# EasyEDA Pro project ProPrj_stm32_SmartCar.epro

# Schematic Schematic1
Board Name: Board1; Create Date: 2025-04-12; Page Name: P1; Project Name: stm32_SmartCar; Schematic Name: Schematic1; Update Date: 2025-04-12; Company: 嘉立创EDA; Page Size: A4; Version: V1.0
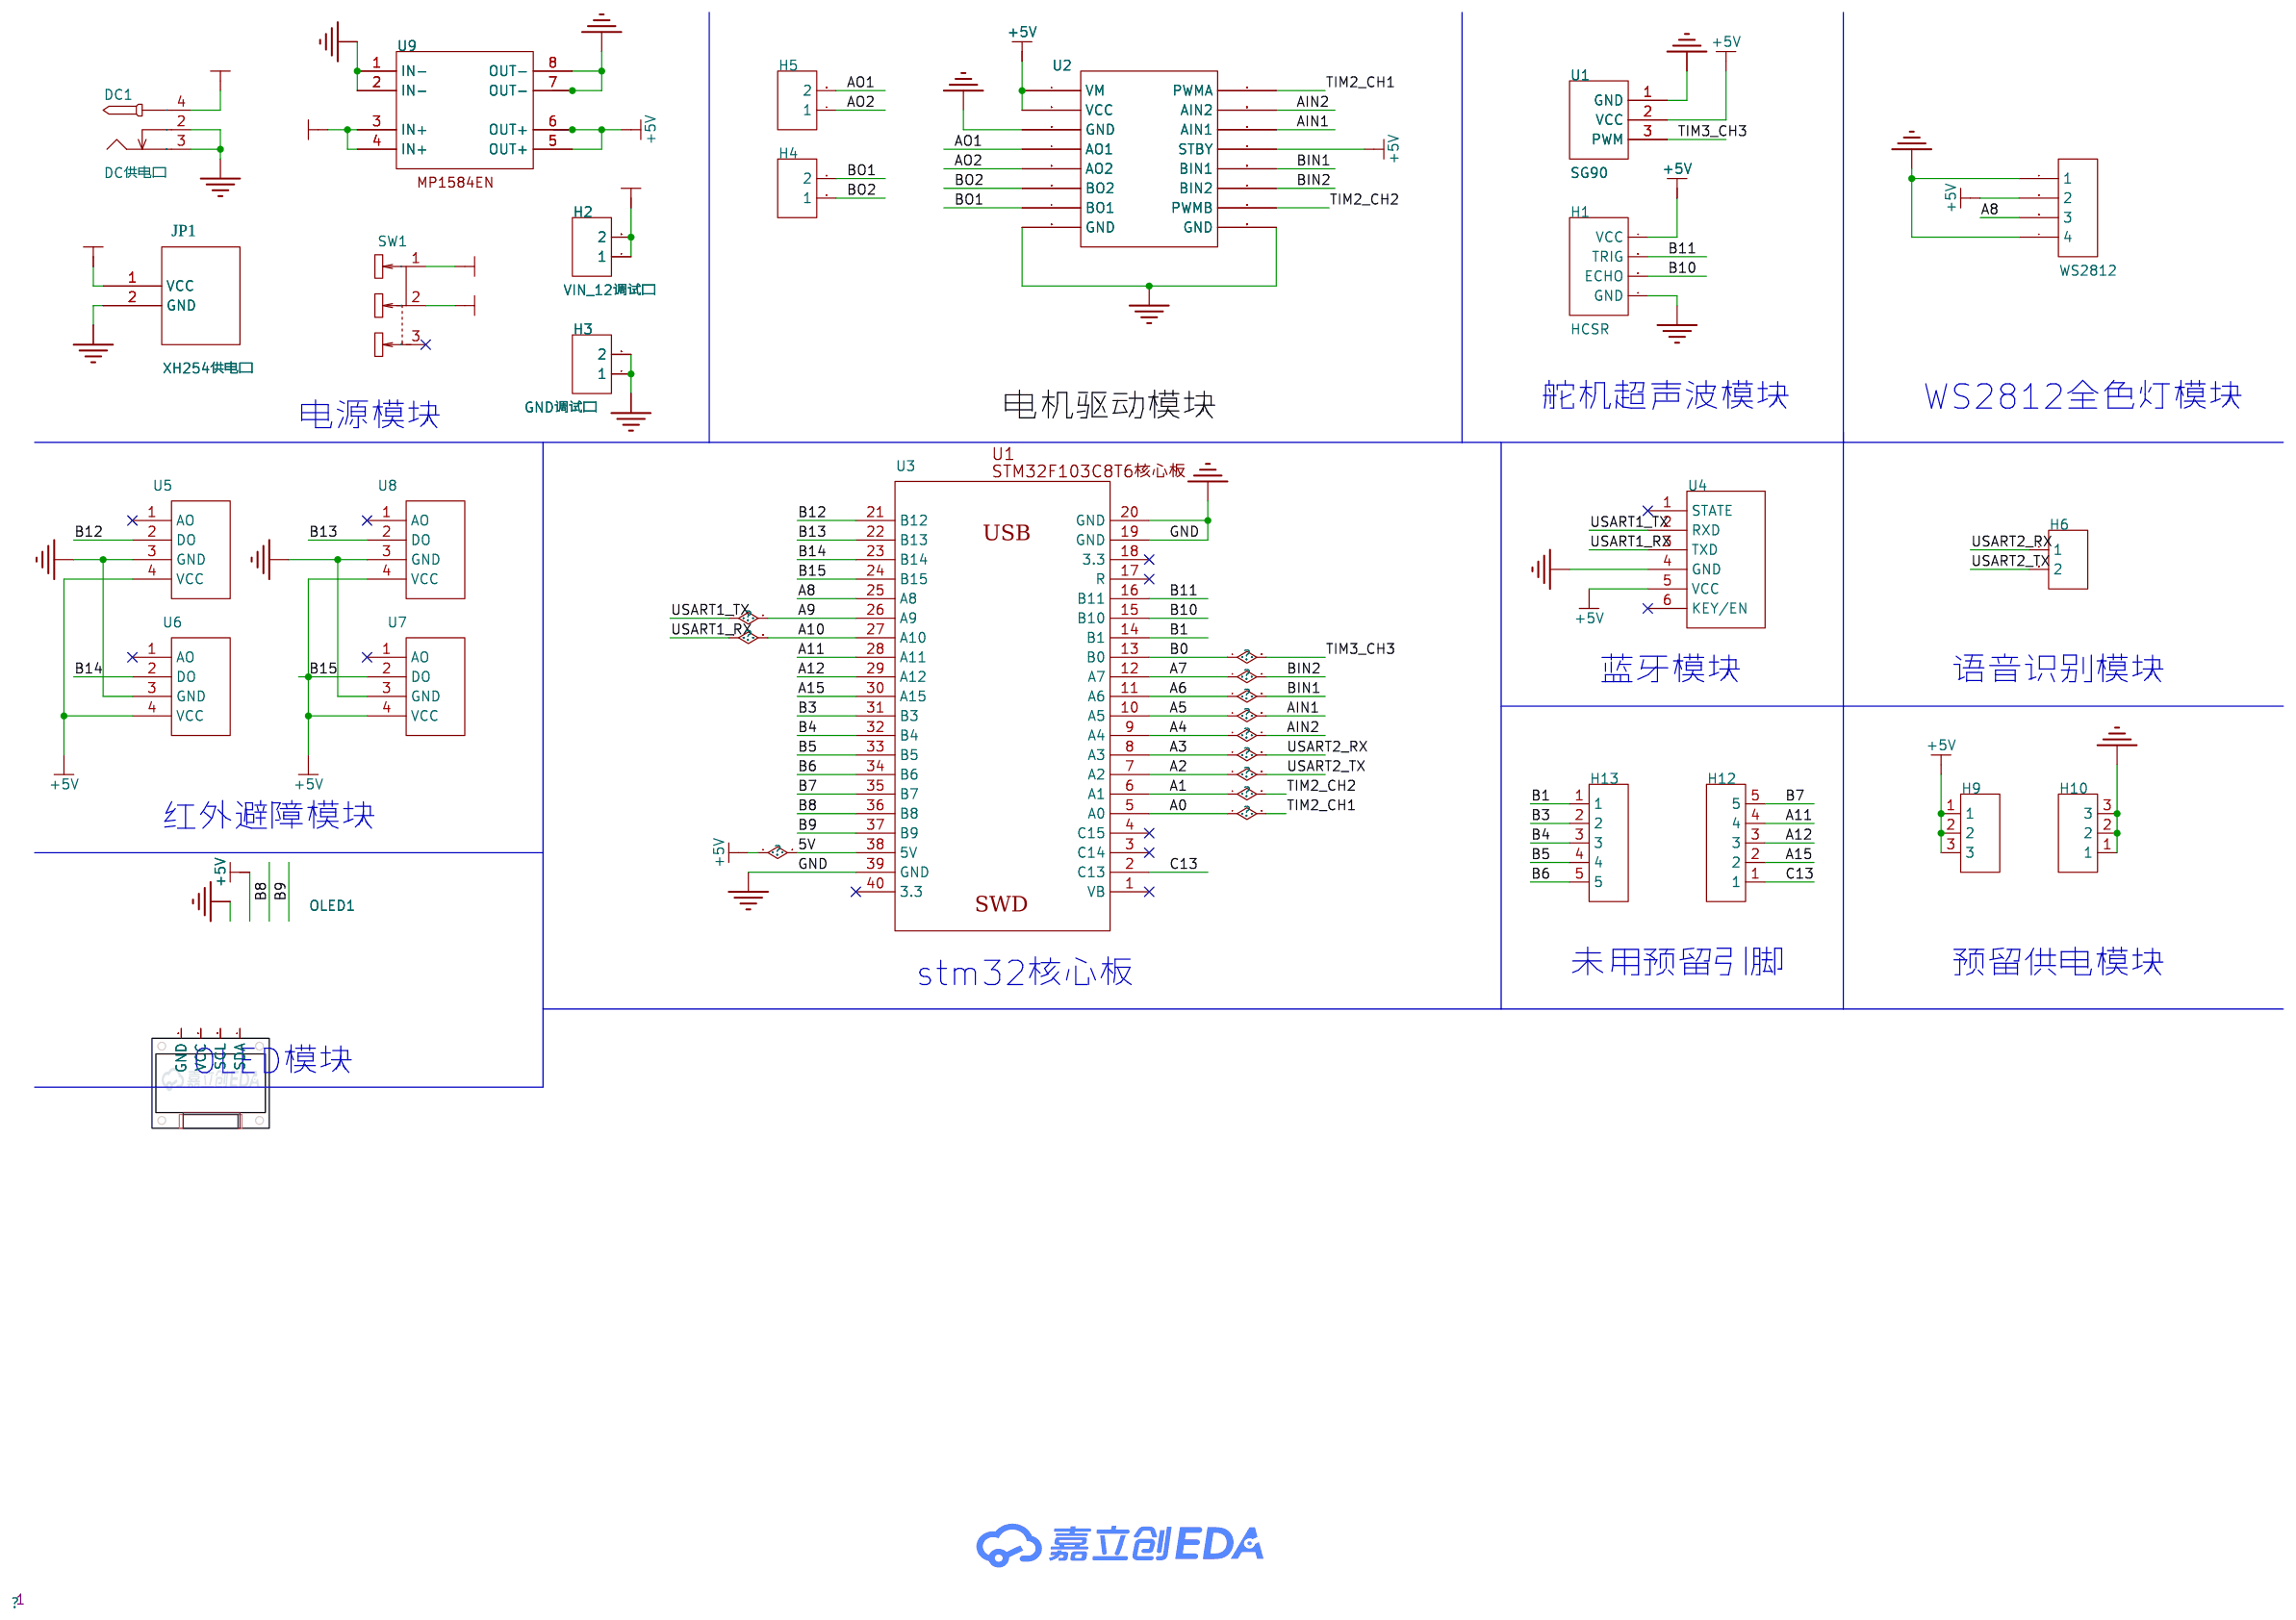
[diagram p0: schematic sheet]

## Parts
DC1  DC供电口  [DC-2.0]
H1  HCSR  [HDR-F-2.54_1X4]
H2  VIN_12调试口  [HDR-TH_2P-P2.54-V-F]
H3  GND调试口  [HDR-TH_2P-P2.54-V-F]
H4  -  [HDR-TH_2P-P2.54-V-F]
H5  -  [HDR-TH_2P-P2.54-V-F]
H6  -  [HDR-TH_2P-P2.54-V-F]
H9  PZ254V-11-03P  [HDR-TH_3P-P2.54-V-M]
H10  PZ254V-11-03P  [HDR-TH_3P-P2.54-V-M]
H12  PZ254V-11-05P  [HDR-TH_5P-P2.54-V-M]
H13  PZ254V-11-05P  [HDR-TH_5P-P2.54-V-M]
JP1  XH254供电口  [XH2.54-2P]
OLED1  -  [0.96OLED_4P]
SW1  SS-12D10L5  [SW-TH_SS-12D10L5]
U1  SG90  [SG90舵机]
U2  TB6612模块  [TB6612FNG]
U3  -  [STM32F103C8T6核心板]
U4  -  [HDR-TH_6P]
U5  -  [HDR-TH_4P-P2.54-V-F_MF254V-11-04-0743]
U6  -  [HDR-TH_4P-P2.54-V-F_MF254V-11-04-0743]
U7  -  [HDR-TH_4P-P2.54-V-F_MF254V-11-04-0743]
U8  -  [HDR-TH_4P-P2.54-V-F_MF254V-11-04-0743]
U9  -  [MP1584EN模块]
预留IIC  WS2812  [LQ_XH254-4P]

## Library data of the parts
DC1 = DC-005_2.0: Supplier Footprint: 插件
H1 = HCSR
H2-H6 = HDR-F_2.54_1x2P: Supplier Part: C49661; Supplier Footprint: 插件
H9 H10 = PZ254V-11-03P: 插针结构:1x3P;间距:2.54mm;行距:-;圆针/方针:方针;安装方式:直插;排数:单排;总PIN位数:3P;额定电流:3A;额定电压:250V;配合针长度:6mm;塑高:2.5mm;端接针长度:3mm;工作温度:-40℃~+105℃;颜色:黑色;; LCSC Part Name: 1x3P 间距:2.54mm 方针 直插; Supplier Part: C2937625; Manufacturer: XFCN(兴飞); Supplier Footprint: 插件,P=2.54mm; JLCPCB Part Class: 扩展库; Datasheet: https://atta.szlcsc.com/upload/public/pdf/source/20200309/C492402_8335C3D49C4E4C618838D59BB1D024C1.pdf; Supplier: LCSC; Pin Structure: 1x3P; Pitch: 2.54mm; Circluar Pins/Square Pins: 方针; Mounting Type: 直插; Number of Rows: 单排; Number of Pins: 3P; Current Rating: 3A; Voltage Rating (Max): 250V; Length of Mating Pin: 6mm; Insulation Height: 2.5mm; Length of End Connection Pin: 3mm; Operating Temperature: -40℃~+105℃; Color: 黑色
H12 H13 = PZ254V-11-05P: 插针结构:1x5P;间距:2.54mm;行距:-;圆针/方针:方针;安装方式:直插;排数:单排;总PIN位数:5P;额定电流:-;额定电压:-;配合针长度:6mm;塑高:2.5mm;端接针长度:3mm;触头材质:黄铜;触头镀层:-;工作温度:-40℃~+105℃;颜色:黑色;; LCSC Part Name: 1x5P 间距:2.54mm 方针 直插; Supplier Part: C492404; Manufacturer: XFCN(兴飞); Supplier Footprint: 插件,P=2.54mm; JLCPCB Part Class: 扩展库; Datasheet: https://atta.szlcsc.com/upload/public/pdf/source/20200309/C492404_E51533260F8710EFF5D4617281164C1D.pdf; Supplier: LCSC; Pin Structure: 1x5P; Pitch: 2.54mm; Circluar Pins/Square Pins: 方针; Mounting Type: 直插; Number of Rows: 单排; Number of Pins: 5P; Length of Mating Pin: 6mm; Insulation Height: 2.5mm; Length of End Connection Pin: 3mm; Contact Material: 黄铜; Operating Temperature: -40℃~+105℃; Color: 黑色
JP1 = XH2.54-2P
OLED1 = 0.96OLED模块_4P: Supplier Footprint: 插件
SW1 = SS-12D10L5: 电路结构:单刀双掷;安装方式:直插;开关颜色:黑色;额定电流(DC):3A;额定电压(DC):125V;额定电流(AC):3A;额定电压(AC):125V;机械寿命:1万次;; LCSC Part Name: 柄长5mm 直插双档 滑动开关; Supplier Part: C319012; Manufacturer: XKB Connectivity(中国星坤); Supplier Footprint: 插件; JLCPCB Part Class: 扩展库; Datasheet: https://atta.szlcsc.com/upload/public/pdf/source/20211009/D6412F37AABE6F9459A6EE7FA4DAEADB.pdf; Supplier: LCSC; Circuit: 单刀双掷; Actuator Style: 矩形柱状; Pin Style: PC引脚; Switch Length: 13mm; Switch Width: 6.8mm; Switch Height: 6.4mm; Mounting Style: 直插; Actuator Color: 黑色; Current Rating (DC): 3A; Voltage Rating (DC): 125V; Current Rating (AC): 3A; Voltage Rating (AC): 125V; Mechanical Life: 1万次; Operating Temperature: -40℃~+85℃
U1 = SG90
U2 = TB6612模块: TB6612FNG电机驱动板模块
U3 = STM32F103核心板
U4 = HC05
U5-U8 = TCRT5000模块
U9 = MP1584EN模块: JLCPCB Part Class: 扩展库; _: 3
预留IIC = CON4

## Nets
+5V: H1.4(VCC) H9.1 H9.2 H9.3 U1.2(VCC) U2.1(VM) U2.2(VCC) U2.12(STBY) U3.38(5V) U4.5(VCC) U5.4(VCC) U6.4(VCC) U7.4(VCC) U8.4(VCC) U9.5(OUT+) U9.6(OUT+) 预留IIC.2
+12V: DC1.4 JP1.1(VCC) SW1.2
GND: DC1.2 DC1.3 H1.1(GND) H3.1 H3.2 H10.1 H10.2 H10.3 JP1.2(GND) U1.1(GND) U2.3(GND) U2.8(GND) U2.16(GND) U3.19(GND) U3.20(GND) U3.39(GND) U4.4(GND) U5.3(GND) U6.3(GND) U7.3(GND) U8.3(GND) U9.1(IN-) U9.2(IN-) U9.7(OUT-) U9.8(OUT-) 预留IIC.1 预留IIC.4
VIN_12V: H2.1 H2.2 SW1.1 U9.3(IN+) U9.4(IN+)
A0: U2.9(PWMA) U3.5(A0)
A1: U2.15(PWMB) U3.6(A1)
A2: H6.2 U3.7(A2)
A3: H6.1 U3.8(A3)
A4: U2.10(AIN2) U3.9(A4)
A5: U2.11(AIN1) U3.10(A5)
A6: U2.13(BIN1) U3.11(A6)
A7: U2.14(BIN2) U3.12(A7)
A8: U3.25(A8) 预留IIC.3
A9: U3.26(A9) U4.2(RXD)
A10: U3.27(A10) U4.3(TXD)
A11: H12.4 U3.28(A11)
A12: H12.3 U3.29(A12)
A15: H12.2 U3.30(A15)
AO1: H5.2 U2.4(AO1)
AO2: H5.1 U2.5(AO2)
B0: U1.3(PWM) U3.13(B0)
B1: H13.1 U3.14(B1)
B3: H13.2 U3.31(B3)
B4: H13.3 U3.32(B4)
B5: H13.4 U3.33(B5)
B6: H13.5 U3.34(B6)
B7: H12.5 U3.35(B7)
B8: U3.36(B8)
B9: U3.37(B9)
B10: H1.2(ECHO) U3.15(B10)
B11: H1.3(TRIG) U3.16(B11)
B12: U3.21(B12) U5.2(DO)
B13: U3.22(B13) U8.2(DO)
B14: U3.23(B14) U6.2(DO)
B15: U3.24(B15) U7.2(DO)
BO1: H4.2 U2.7(BO1)
BO2: H4.1 U2.6(BO2)
C13: H12.1 U3.2(C13)

Not connected (* = marked no-connect by the designer): OLED1 1(GND) 2(VCC) 3(SCL) 4(SDA); SW1 3*; U3 1(VB)* 3(C14)* 4(C15)* 17(R)* 18(3.3)* 40(3.3)*; U4 1(STATE)* 6(KEY/EN)*; U5 1(AO)*; U6 1(AO)*; U7 1(AO)*; U8 1(AO)*

## Notes on the sheet
- 舵机超声波模块
- WS2812全色灯模块
- 电源模块
- 电机驱动模块
- 蓝牙模块
- 语音识别模块
- 红外避障模块
- stm32核心板
- 未用预留引脚
- 预留供电模块
- OLED模块

# Board PCB1
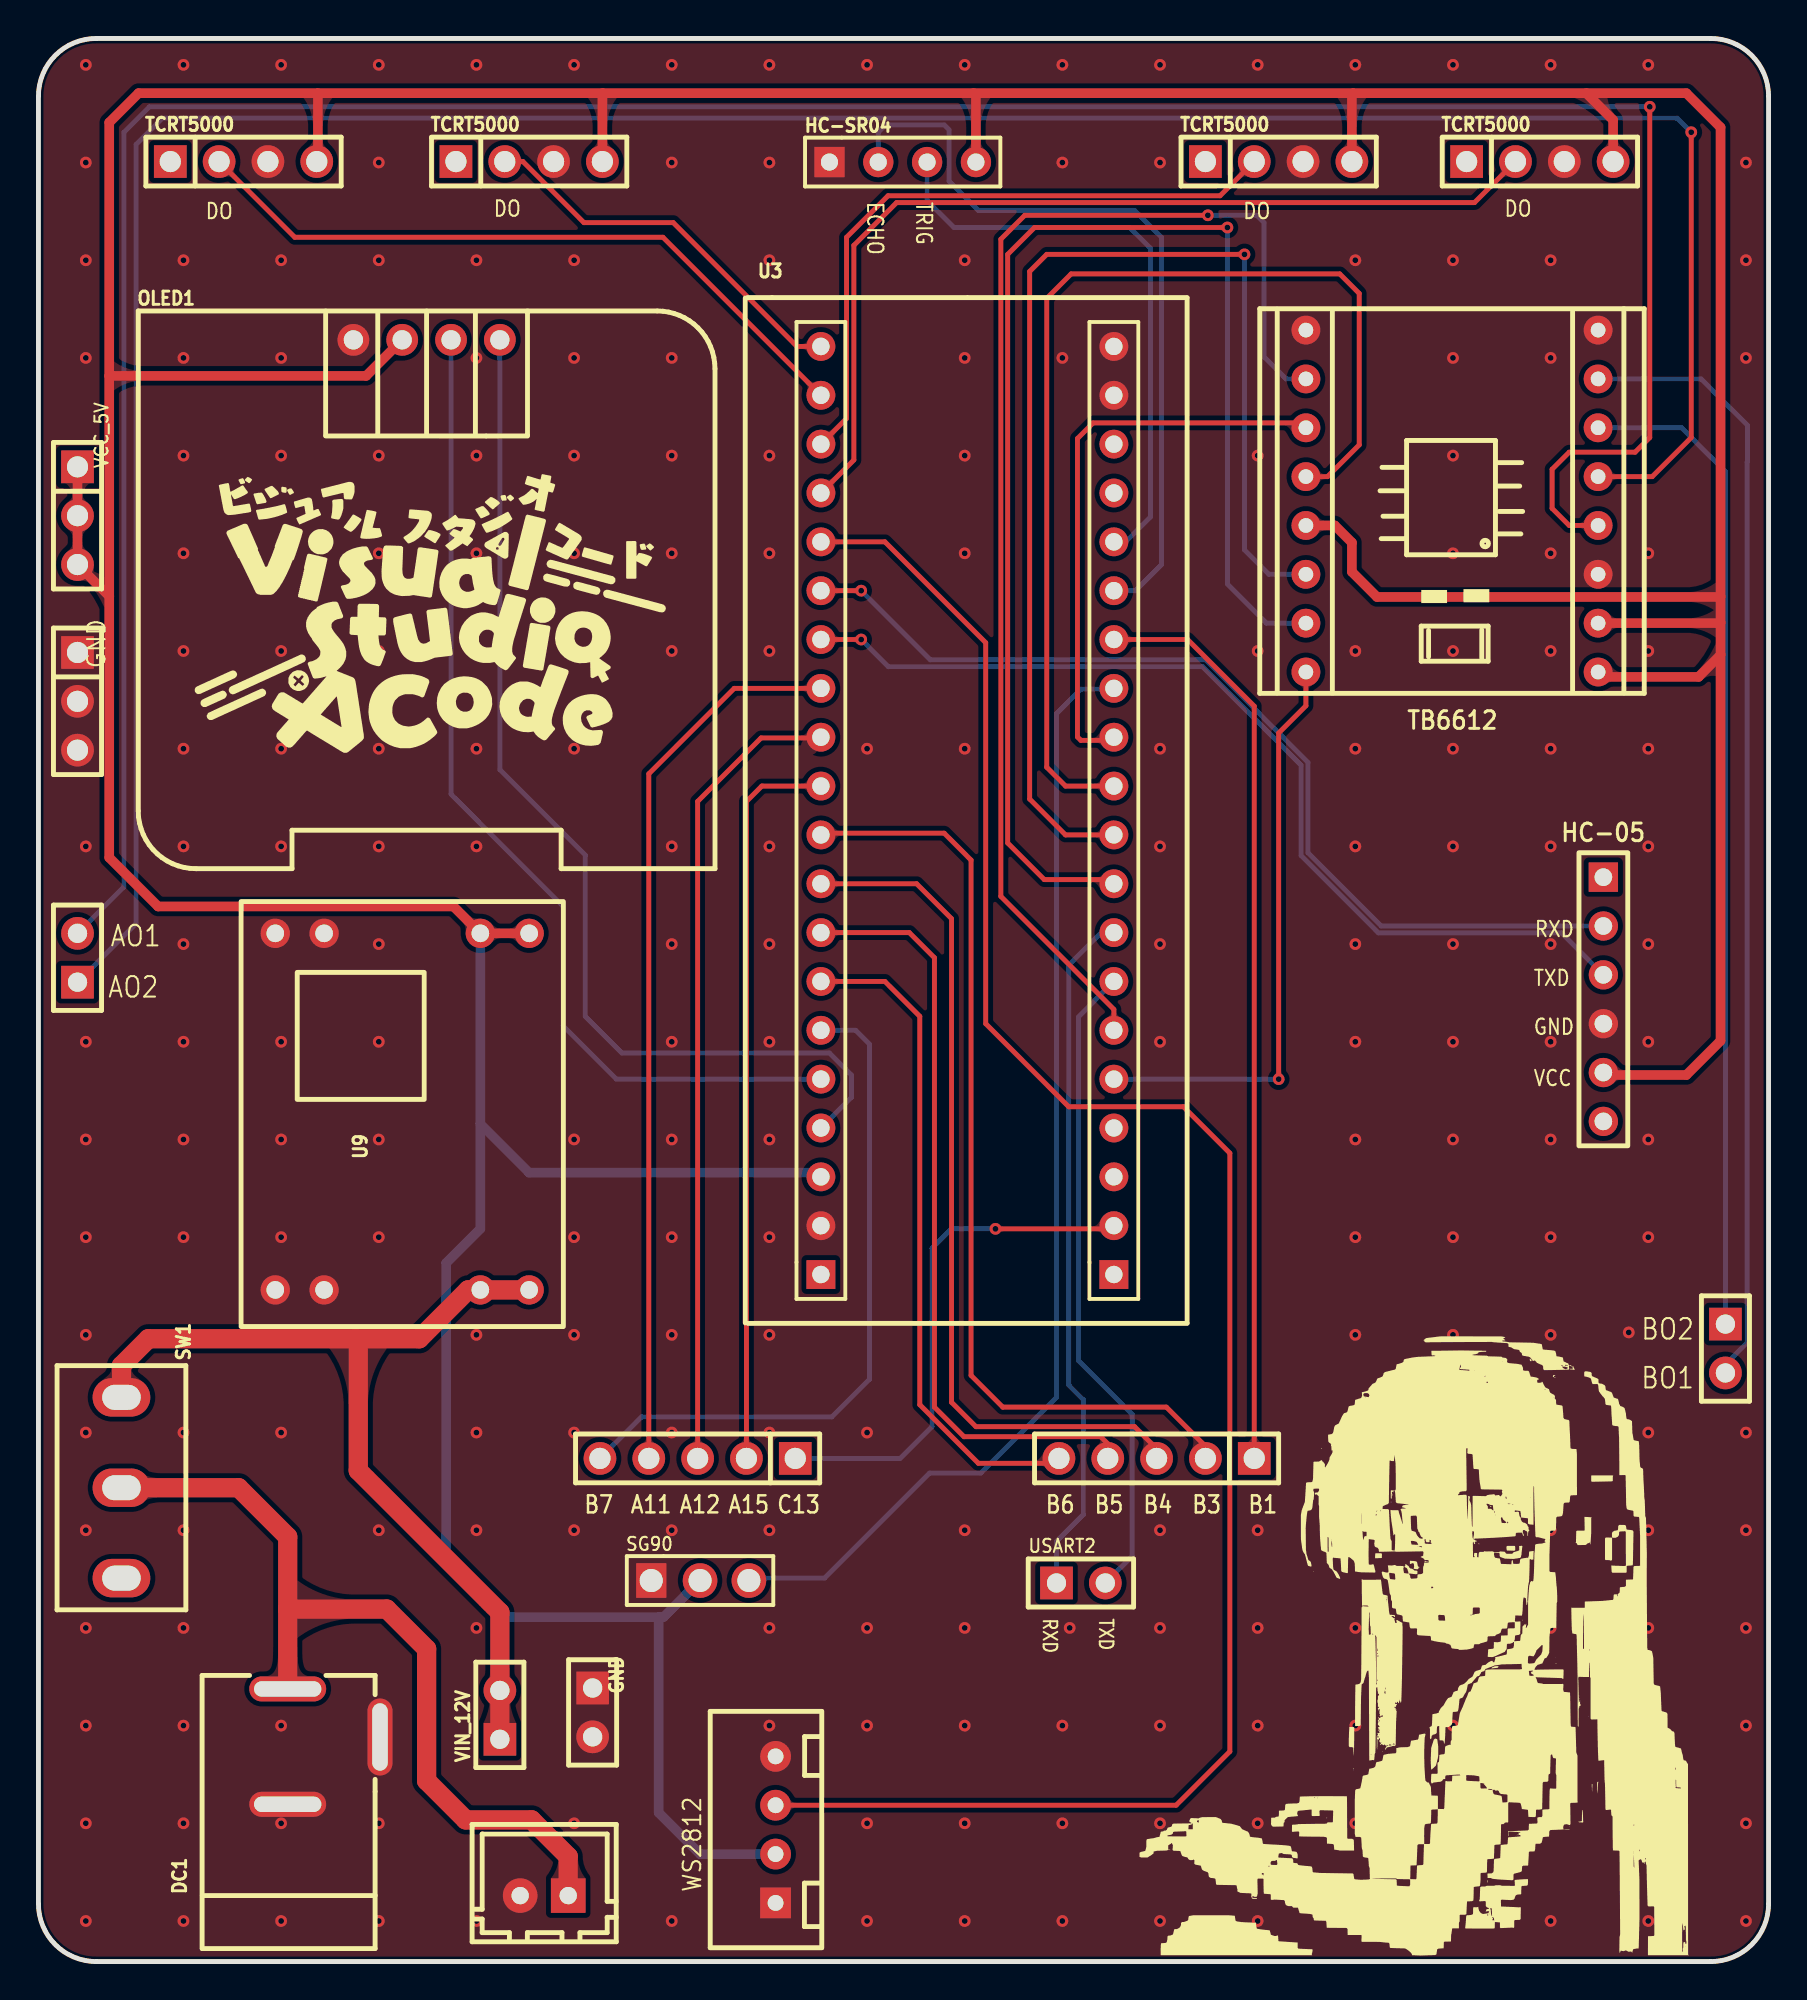
[diagram p1: board, top side]
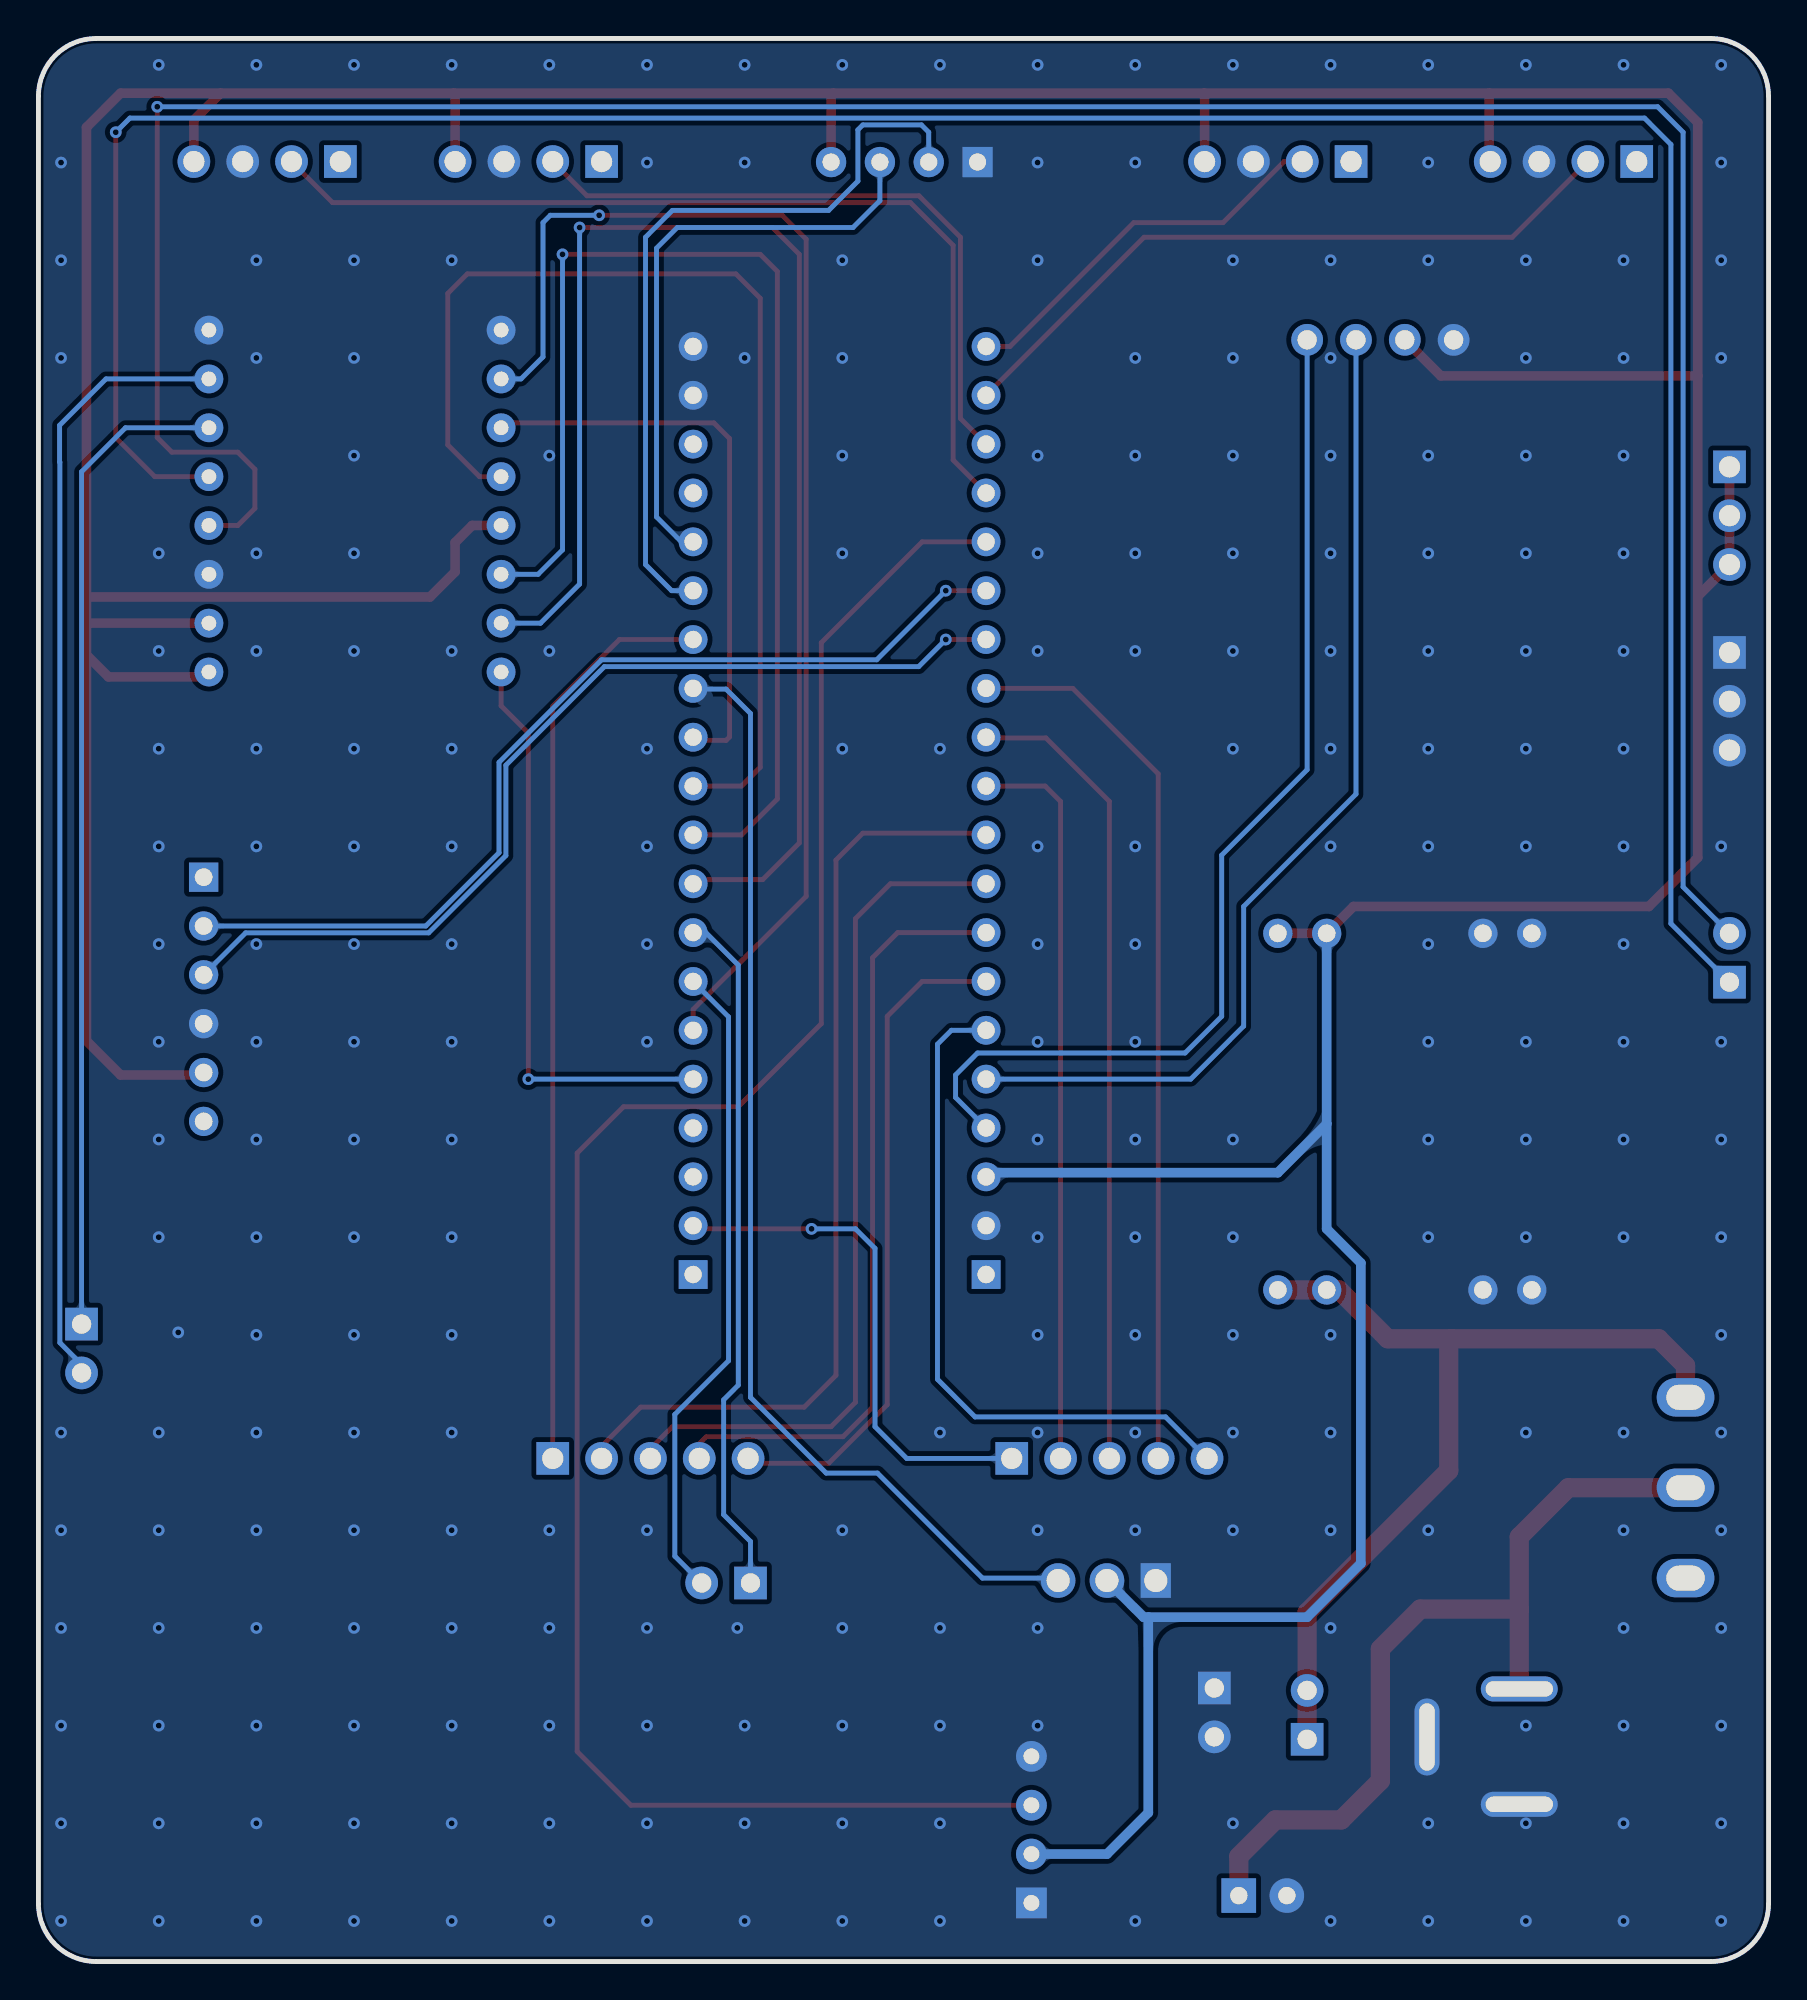
[diagram p2: board, bottom side, seen from below]

Outline 90 x 100 mm; copper layers: Top Layer, Bottom Layer. Coordinates in mm from the lower left corner of the outline.
Outline path: 0,97 0,3 arc(0.88,0.88) 3,0 87,0 arc(89.12,0.88) 90,3 90,97 arc(89.12,99.12) 87,100 3,100 arc(0.88,99.12) 0,97
Stack: Top Layer 0.035mm / Dielectric1 1.51mm FR4 er 4.5 / Bottom Layer 0.035mm

## Design rules (mm)
template: 自定义配置
spacing copperThickness1oz (default): track to track 0.102, other pairs 0.152 to 0.3
spacing copperThickness2oz: track to track 0.203, other pairs 0.152 to 0.3
track width copperThickness1oz (default): min 0.127, default 0.254, max 2.54
track width copperThickness2oz: min 0.203, default 0.254, max 2.54
differential pair differentialPair (default): width min 0.127, default 0.254, max 2.54; gap min 0.152, default 0.152
via viaSize (default): diameter min 0.5, default 0.61, max 10; hole min 0.3, default 0.305, max 6.3

## Placement (name value [footprint] x y rotation side)
DC1  DC供电口  [DC-2.0]  12.7 11.05 270 top
GND  -  [HDR-TH_2P-P2.54-V-F]  28.83 12.95 270 top
GND#2  -  [HDR-TH_3P-P2.54-V-M]  2.03 65.53 270 top
H4  -  [HDR-TH_2P-P2.54-V-F]  87.76 31.88 270 top
H5  -  [HDR-TH_2P-P2.54-V-F]  2.03 52.2 90 top
H12  PZ254V-11-05P  [HDR-TH_5P-P2.54-V-M]  34.29 26.16 180 top
H13  PZ254V-11-05P  [HDR-TH_5P-P2.54-V-M]  58.17 26.16 180 top
HC-05  -  [HDR-TH_6P]  81.41 50.04 0 top
HC-SR04  HCSR  [HDR-F-2.54_1X4]  44.96 93.57 0 top
JP1  XH254供电口  [XH2.54-2P]  27.56 3.43 180 top
OLED1  -  [0.96OLED_4P]  20.19 84.33 0 top
SG90  SG90  [SG90舵机]  34.8 19.56 0 top
SW1  SS-12D10L5  [SW-TH_SS-12D10L5]  4.32 24.64 270 top
TB6612  TB6612模块  [TB6612FNG]  73.53 75.95 180 top
TCRT5000  -  [HDR-TH_4P-P2.54-V-F_MF254V-11-04-0743]  25.53 93.6 0 top
TCRT5000#2  -  [HDR-TH_4P-P2.54-V-F_MF254V-11-04-0743]  64.52 93.6 0 top
TCRT5000#3  -  [HDR-TH_4P-P2.54-V-F_MF254V-11-04-0743]  78.1 93.6 0 top
TCRT5000#4  -  [HDR-TH_4P-P2.54-V-F_MF254V-11-04-0743]  10.67 93.6 0 top
U3  -  [STM32F103C8T6核心板]  48.64 58.55 0 top
U9  -  [MP1584EN模块]  19.18 43.69 90 top
USART2  -  [HDR-TH_2P-P2.54-V-F]  54.23 19.69 0 top
VCC_5V  PZ254V-11-03P  [HDR-TH_3P-P2.54-V-M]  2.03 75.18 270 top
VIN_12V  VIN_12调试口  [HDR-TH_2P-P2.54-V-F]  24 12.83 90 top
WS2812  WS2812  [LQ_XH254-4P]  37.85 3.05 90 top

## Footprints (pads in the part's own frame, mm; a bottom-side part is the same pattern mirrored in y, then rotated)
0.96OLED_4P
  round 1.65 hole 1: 1(-3.81,-0.002) 2(-1.27,0.002) 3(1.27,0.002) 4(3.81,0.002)
DC-2.0
  oval 4x1.3 hole 3.5x0.8: 2(-0.627,5.067)
  oval 1.3x4 hole 0.8x3.5: 3(2.873,0.267) 4(-3.127,0.267)
HDR-F-2.54_1X4
  rect 1.575x1.575 hole 0.889: 1(-3.81,0)
  round 1.575 hole 0.889: 2(-1.27,-0.001) 3(1.27,-0.001) 4(3.809,-0.001)
HDR-TH_2P-P2.54-V-F
  rect 1.7x1.7 hole 1: 1(-1.27,0)
  round 1.7 hole 1: 2(1.27,0)
HDR-TH_3P-P2.54-V-M
  rect 1.7x1.7 hole 1.1: 1(-2.54,0)
  round 1.7 hole 1.1: 2(0,0) 3(2.54,0)
HDR-TH_4P-P2.54-V-F_MF254V-11-04-0743
  rect 1.7x1.7 hole 1.1: 1(-3.81,0)
  round 1.7 hole 1.1: 2(-1.27,0) 3(1.27,0) 4(3.81,0)
HDR-TH_5P-P2.54-V-M
  rect 1.7x1.7 hole 1.1: 1(-5.08,0)
  round 1.7 hole 1.1: 2(-2.54,0) 3(0,0) 4(2.54,0) 5(5.08,0)
HDR-TH_6P
  rect 1.524x1.524 hole 0.914: 1(0,6.35)
  round 1.524 hole 0.914: 2(0,3.81) 3(0,1.27) 4(0,-1.27) 5(0,-3.81) 6(0,-6.35)
LQ_XH254-4P
  rect 1.6x1.6 hole 0.82: 1(0,-0.5)
  round 1.6 hole 0.82: 2(2.54,-0.5) 3(5.08,-0.5) 4(7.62,-0.5)
MP1584EN模块
  round 1.524 hole 0.914: 1(-8.763,6.858) 2(-8.763,4.318) 3(-8.763,-3.81) 4(-8.763,-6.35) 5(9.779,-6.35) 6(9.779,-3.81) 7(9.779,4.318) 8(9.779,6.858)
SG90舵机
  rect 1.575x1.8 hole 1.2: 1(-2.921,0.254)
  round 1.8 hole 1.2: 2(-0.381,0.254) 3(2.159,0.254)
STM32F103C8T6核心板
  rect 1.5x1.5 hole 0.9: 1(7.303,-22.822)
  round 1.5 hole 0.9: 2(7.303,-20.282) 3(7.303,-17.742) 4(7.303,-15.202) 5(7.303,-12.662) 6(7.303,-10.122) 7(7.303,-7.582) 8(7.303,-5.042) 9(7.303,-2.502) 10(7.303,0.038) 11(7.303,2.578) 12(7.303,5.118) 14(7.303,10.198) 18(7.303,20.358) 19(7.303,22.898) 20(7.303,25.438)
  round 1.5 hole 0.9x0.905: 13(7.303,7.658) 15(7.303,12.738) 16(7.303,15.278) 17(7.303,17.818) 21(-7.938,25.438) 22(-7.938,22.898) 23(-7.938,20.358) 24(-7.938,17.818) 25(-7.938,15.278) 26(-7.938,12.738) 27(-7.938,10.198) 28(-7.938,7.658) 29(-7.938,5.118) 30(-7.938,2.578) 31(-7.938,0.038) 32(-7.938,-2.502) 33(-7.938,-5.042) 34(-7.938,-7.582) 35(-7.938,-10.122) 36(-7.938,-12.662) 37(-7.938,-15.202) 38(-7.938,-17.742) 39(-7.938,-20.282)
  rect 1.5x1.5 hole 0.9x0.905: 40(-7.938,-22.822)
SW-TH_SS-12D10L5
  oval 2x3 hole 1.3x2: 1(-4.7,0) 2(0,0) 3(4.7,0)
TB6612FNG
  round 1.5 hole 0.762: 1(-7.6,8.89) 2(-7.6,6.35) 3(-7.6,3.81) 4(-7.6,1.27) 5(-7.6,-1.27) 6(-7.6,-3.81) 7(-7.6,-6.35) 8(-7.6,-8.89) 9(7.6,8.89) 10(7.6,6.35) 11(7.6,3.81) 12(7.6,1.27) 13(7.6,-1.27) 14(7.6,-3.81) 15(7.6,-6.35) 16(7.6,-8.89)
XH2.54-2P
  rect 1.8x1.8 hole 0.9: 1(0,0)
  round 1.8 hole 0.9: 2(2.5,0)

## Nets
+5V: HC-05.5 HC-SR04.4 OLED1.2 SG90.2 TB6612.1 TB6612.2 TB6612.12 TCRT5000.4 TCRT5000#2.4 TCRT5000#3.4 TCRT5000#4.4 U3.38 U9.5 U9.6 VCC_5V.1 VCC_5V.2 VCC_5V.3 WS2812.2
+12V: DC1.4 JP1.1 SW1.2
GND: DC1.2 DC1.3 GND.1 GND.2 GND#2.1 GND#2.2 GND#2.3 HC-05.4 HC-SR04.1 JP1.2 OLED1.1 SG90.1 TB6612.3 TB6612.8 TB6612.16 TCRT5000.3 TCRT5000#2.3 TCRT5000#3.3 TCRT5000#4.3 U3.19 U3.20 U3.39 U9.1 U9.2 U9.7 U9.8 WS2812.1 WS2812.4
VIN_12V: SW1.1 U9.3 U9.4 VIN_12V.1 VIN_12V.2
A0: TB6612.9 U3.5
A1: TB6612.15 U3.6
A2: U3.7 USART2.2
A3: U3.8 USART2.1
A4: TB6612.10 U3.9
A5: TB6612.11 U3.10
A6: TB6612.13 U3.11
A7: TB6612.14 U3.12
A8: U3.25 WS2812.3
A9: HC-05.2 U3.26
A10: HC-05.3 U3.27
A11: H12.4 U3.28
A12: H12.3 U3.29
A15: H12.2 U3.30
AO1: H5.2 TB6612.4
AO2: H5.1 TB6612.5
B0: SG90.3 U3.13
B1: H13.1 U3.14
B3: H13.2 U3.31
B4: H13.3 U3.32
B5: H13.4 U3.33
B6: H13.5 U3.34
B7: H12.5 U3.35
B8: OLED1.3 U3.36
B9: OLED1.4 U3.37
B10: HC-SR04.2 U3.15
B11: HC-SR04.3 U3.16
B12: TCRT5000.2 U3.21
B13: TCRT5000#4.2 U3.22
B14: TCRT5000#2.2 U3.23
B15: TCRT5000#3.2 U3.24
BO1: H4.2 TB6612.7
BO2: H4.1 TB6612.6
C13: H12.1 U3.2

Pads without a net: HC-05 1 6; SW1 3; TCRT5000 1; TCRT5000#2 1; TCRT5000#3 1; TCRT5000#4 1; U3 1 3 4 17 18 40

## Via types
v1: diameter 0.61, hole 0.305, Top Layer to Bottom Layer, 251 vias

## Routing (per net, layer and track width the routed paths; a pad name or vN(x,y) marks a point on that pad's centre or on a via; arc(x,y) is an arc through that point)
+5V: length 365.2
  Top Layer w0.5: 87.5,70.96 87.5,69.61 ; 87.5,70.96 87.5,95.38 85.72,97.16 80.52,97.16 ; 87.5,70.96 69.63,70.96 68.33,72.26 68.33,73.79 67.44,74.68 TB6612.12 ; 87.5,69.61 87.5,67.94 ; 87.5,69.61 87.49,69.6 TB6612.2 ; 14.54,97.16 5.21,97.16 3.68,95.63 3.68,82.46 ; 14.54,97.16 14.54,93.66 TCRT5000#4.4 ; 14.54,97.16 29.35,97.16 ; 87.5,67.94 87.5,47.88 85.72,46.1 81.53,46.1 HC-05.5 ; 87.5,67.94 86.36,66.8 81.39,66.8 TB6612.1 ; 29.35,97.16 29.34,97.14 TCRT5000.4 ; 29.35,97.16 48.65,97.16 ; 48.77,93.57 48.77,97.04 48.65,97.16 ; 68.39,97.16 80.52,97.16 ; 68.39,97.16 68.33,97.09 TCRT5000#2.4 ; 68.39,97.16 48.65,97.16 ; 80.52,97.16 81.91,95.76 TCRT5000#3.4 ; 3.68,70.99 VCC_5V.3 VCC_5V.2 VCC_5V.1 ; 3.68,70.99 3.68,57.4 6.22,54.86 21.59,54.86 U9.6 U9.5 ; 3.68,70.99 3.68,82.46 ; 3.68,82.46 17.05,82.46 OLED1.2
  Bottom Layer w0.5: 32.26,17.91 32.26,7.74 34.42,5.59 WS2812.2 ; 32.26,17.91 24,17.91 21.21,20.7 21.21,36.32 22.99,38.1 22.99,43.56 ; 32.26,17.91 32.51,17.91 SG90.2 ; 22.99,43.56 25.53,41.02 40.49,41.02 U3.38 ; 22.99,43.56 U9.6
+12V: length 43.6
  Top Layer w1: SW1.2 10.41,24.64 12.97,22.09 12.97,18.33 ; DC1.4 12.97,18.33 ; 12.97,18.33 18.12,18.33 20.19,16.26 20.19,9.4 22.22,7.37 25.65,7.37 27.56,5.46 JP1.1
GND:
  vias: v1(2.46,98.63) v1(2.46,93.55) v1(2.46,88.47) v1(2.46,83.39) v1(2.46,57.99) v1(2.46,47.83) v1(2.46,42.75) v1(2.46,37.67) v1(2.46,32.59) v1(2.46,27.51) v1(2.46,22.43) v1(2.46,17.35) v1(2.46,12.27) v1(2.46,7.19) v1(2.46,2.11) v1(7.54,98.63) v1(7.54,88.47) v1(7.54,83.39) v1(7.54,78.31) v1(7.54,73.23) v1(7.54,68.15) v1(7.54,63.07) v1(7.54,57.99) v1(7.54,52.91) v1(7.54,47.83) v1(7.54,42.75) v1(7.54,37.67) v1(7.54,27.51) v1(7.54,22.43) v1(7.54,17.35) v1(7.54,12.27) v1(7.54,7.19) v1(7.54,2.11) v1(12.62,98.63) v1(12.62,88.47) v1(12.62,83.39) v1(12.62,78.31) v1(12.62,73.23) v1(12.62,68.15) v1(12.62,63.07) v1(12.62,57.99) v1(12.62,47.83) v1(12.62,42.75) v1(12.62,37.67) v1(12.62,27.51) v1(12.62,12.27) v1(12.62,7.19) v1(12.62,2.11) v1(17.7,98.63) v1(17.7,93.55) v1(17.7,88.47) v1(17.7,78.31) v1(17.7,73.23) v1(17.7,68.15) v1(17.7,63.07) v1(17.7,57.99) v1(17.7,52.91) v1(17.7,47.83) v1(17.7,42.75) v1(17.7,37.67) v1(17.7,22.43) v1(17.7,7.19) v1(17.7,2.11) v1(22.78,98.63) v1(22.78,88.47) v1(22.78,83.39) v1(22.78,78.31) v1(22.78,73.23) v1(22.78,68.15) v1(22.78,63.07) v1(22.78,57.99) v1(22.78,32.59) v1(22.78,27.51) v1(22.78,22.43) v1(22.78,17.35) v1(22.78,2.11) v1(27.86,98.63) v1(27.86,88.47) v1(27.86,83.39) v1(27.86,78.31) v1(27.86,73.23) v1(27.86,68.15) v1(27.86,63.07) v1(27.86,42.75) v1(27.86,37.67) v1(27.86,32.59) v1(27.86,27.51) v1(27.86,22.43) v1(27.86,7.19) v1(32.94,98.63) v1(32.94,93.55) v1(32.94,83.39) v1(32.94,78.31) v1(32.94,73.23) v1(32.94,68.15) v1(32.94,57.99) v1(32.94,52.91) v1(32.94,47.83) v1(32.94,42.75) v1(32.94,37.67) v1(32.94,32.59) v1(32.94,27.51) v1(32.94,22.43) v1(32.94,2.11) v1(38.02,98.63) v1(38.02,93.55) v1(38.02,88.47) v1(38.02,78.31) v1(38.02,73.23) v1(38.02,68.15) v1(38.02,57.99) v1(38.02,52.91) v1(38.02,47.83) v1(38.02,42.75) v1(38.02,37.67) v1(38.02,32.59) v1(38.02,27.51) v1(38.02,22.43) v1(38.02,17.35) v1(38.02,12.27) v1(43.1,98.63) v1(43.1,63.07) v1(43.1,27.51) v1(43.1,17.35) v1(43.1,12.27) v1(43.1,7.19) v1(43.1,2.11) v1(48.18,98.63) v1(48.18,88.47) v1(48.18,83.39) v1(48.18,78.31) v1(48.18,73.23) v1(48.18,63.07) v1(48.18,22.43) v1(48.18,17.35) v1(48.18,12.27) v1(48.18,7.19) v1(48.18,2.11) v1(53.26,98.63) v1(53.26,93.55) v1(53.26,83.39) v1(53.26,12.27) v1(53.26,7.19) v1(53.26,2.11) v1(53.65,17.35) v1(58.34,98.63) v1(58.34,93.55) v1(58.34,63.07) v1(58.34,57.99) v1(58.34,52.91) v1(58.34,47.83) v1(58.34,22.43) v1(58.34,17.35) v1(58.34,12.27) v1(58.34,7.19) v1(58.34,2.11) v1(63.42,98.63) v1(63.42,78.31) v1(63.42,68.15) v1(63.42,22.43) v1(63.42,17.35) v1(63.42,12.27) v1(63.42,7.19) v1(63.42,2.11) v1(68.5,98.63) v1(68.5,88.47) v1(68.5,68.15) v1(68.5,63.07) v1(68.5,57.99) v1(68.5,52.91) v1(68.5,47.83) v1(68.5,42.75) v1(68.5,37.67) v1(68.5,32.59) v1(68.5,27.51) v1(68.5,22.43) v1(68.5,17.35) v1(68.5,12.27) v1(68.5,7.19) v1(68.5,2.11) v1(73.58,98.63) v1(73.58,88.47) v1(73.58,83.39) v1(73.58,78.31) v1(73.58,73.23) v1(73.58,68.15) v1(73.58,63.07) v1(73.58,57.99) v1(73.58,52.91) v1(73.58,47.83) v1(73.58,42.75) v1(73.58,37.67) v1(73.58,32.59) v1(73.58,27.51) v1(73.58,22.43) v1(73.58,17.35) v1(73.58,12.27) v1(73.58,7.19) v1(73.58,2.11) v1(78.66,98.63) v1(78.66,88.47) v1(78.66,83.39) v1(78.66,73.23) v1(78.66,68.15) v1(78.66,63.07) v1(78.66,57.99) v1(78.66,52.91) v1(78.66,47.83) v1(78.66,42.75) v1(78.66,37.67) v1(78.66,32.59) v1(78.66,27.51) v1(78.66,22.43) v1(78.66,17.35) v1(78.66,12.27) v1(78.66,7.19) v1(78.66,2.11) v1(82.73,32.72) v1(83.74,98.63) v1(83.74,73.23) v1(83.74,68.15) v1(83.74,63.07) v1(83.74,57.99) v1(83.74,52.91) v1(83.74,47.83) v1(83.74,42.75) v1(83.74,37.67) v1(83.74,27.51) v1(83.74,22.43) v1(83.74,17.35) v1(83.74,12.27) v1(83.74,7.19) v1(83.74,2.11) v1(88.82,93.55) v1(88.82,88.47) v1(88.82,83.39) v1(88.82,27.51) v1(88.82,22.43) v1(88.82,17.35) v1(88.82,12.27) v1(88.82,7.19) v1(88.82,2.11)
VIN_12V: length 48.4
  Top Layer w1: 16.49,32.39 19.81,32.39 22.35,34.92 U9.4 ; 16.49,32.39 5.72,32.39 4.32,30.99 SW1.1 ; 16.49,32.39 16.64,32.24 16.64,25.53 24,18.16 VIN_12V.2 VIN_12V.1
A0: length 30.3
  Top Layer w0.254: TB6612.9 65.93,65.3 64.52,63.88 v1(64.52,45.89)
  Bottom Layer w0.254: U3.5 v1(64.52,45.89)
A1: length 67.6
  Top Layer w0.254: U3.6 55.94,49.51 50.06,55.39 50.06,89.56 51.31,90.81 v1(60.83,90.81)
  Bottom Layer w0.254: v1(60.83,90.81) 63.37,90.81 63.75,90.42 63.75,83.44 64.9,82.3 TB6612.15
A2: length 33.8
  Bottom Layer w0.254: U3.7 54.1,49.12 54.1,31.24 56.9,28.45 56.9,21.08 USART2.2
A3: length 36.1
  Bottom Layer w0.254: USART2.1 52.96,21.84 54.36,23.24 54.36,29.21 53.59,29.97 53.59,51.82 55.28,53.5 U3.8
A4: length 72.5
  Top Layer w0.254: U3.9 55.73,56.26 52.32,56.26 50.42,58.17 50.42,88.77 51.82,90.17 v1(61.85,90.17)
  Bottom Layer w0.254: v1(61.85,90.17) 61.85,71.63 63.88,69.6 TB6612.10
A5: length 63.2
  Top Layer w0.254: v1(62.74,88.77) 52.45,88.77 51.56,87.88 51.56,60.45 53.43,58.58 U3.10
  Bottom Layer w0.254: v1(62.74,88.77) 62.74,73.41 64.01,72.14 TB6612.11
A6: length 56.8
  Top Layer w0.254: TB6612.13 67.06,77.22 68.71,78.87 68.71,86.74 67.69,87.76 53.72,87.76 52.45,86.49 52.45,62.1 53.43,61.12 U3.11
A7: length 29.9
  Top Layer w0.254: TB6612.14 65.68,80.01 54.86,80.01 54.05,79.2 54.05,63.68 54.23,63.5 55.78,63.5 U3.12
A8: length 101.9
  Top Layer w0.254: WS2812.3 59.18,8.13 61.98,10.92 61.98,42.04 59.56,44.45 53.59,44.45 49.28,48.77 49.28,68.58 44.03,73.83 U3.25
A9: length 50.7
  Top Layer w0.254: U3.26 v1(42.8,71.28)
  Bottom Layer w0.254: v1(42.8,71.28) 46.39,67.69 60.71,67.69 66.04,62.36 66.04,57.66 69.85,53.85 HC-05.2
A10: length 50.7
  Top Layer w0.254: U3.27 v1(42.8,68.75)
  Bottom Layer w0.254: v1(42.8,68.75) 44.21,67.33 60.56,67.33 65.68,62.21 65.68,57.51 69.7,53.49 79.22,53.49 HC-05.3
A11: length 46.4
  Top Layer w0.254: U3.28 36.19,66.2 31.75,61.76 H12.4
A12: length 42
  Top Layer w0.254: H12.3 34.29,60.33 37.59,63.63 40.67,63.63 U3.29
A15: length 38.4
  Top Layer w0.254: H12.2 36.83,60.33 37.63,61.12 U3.30
AO1: length 150.3
  Top Layer w0.254: TB6612.4 79.63,74.68 78.74,75.56 78.74,77.6 79.63,78.49 83.06,78.49 83.82,79.25 v1(83.82,96.45)
  Bottom Layer w0.254: v1(83.82,96.45) 5.77,96.45 4.44,95.12 4.44,55.88 H5.2
AO2: length 148.2
  Top Layer w0.254: TB6612.5 83.95,77.22 85.98,79.25 v1(85.98,95.12)
  Bottom Layer w0.254: v1(85.98,95.12) 85.24,95.86 6.45,95.86 5.08,94.49 5.08,53.97 H5.1
B0: length 59
  Bottom Layer w0.254: SG90.3 37.08,19.94 40.89,19.94 46.35,25.4 49.02,25.4 52.96,29.34 52.96,64.9 54.23,66.17 55.91,66.17 U3.13
B1: length 47.9
  Top Layer w0.254: U3.14 59.78,68.75 63.25,65.28 H13.1
B3: length 49.6
  Top Layer w0.254: U3.31 40.79,58.67 47.12,58.67 48.51,57.28 48.51,30.48 50.16,28.83 58.67,28.83 60.71,26.8 H13.2
B4: length 44.9
  Top Layer w0.254: H13.3 58.17,26.67 57.02,27.81 48.77,27.81 47.5,29.08 47.5,54.23 45.68,56.05 U3.32
B5: length 40.4
  Top Layer w0.254: U3.33 45.3,53.5 46.61,52.2 46.61,28.83 48.15,27.29 55.26,27.29 55.63,26.92 H13.4
B6: length 34.7
  Top Layer w0.254: H13.5 52.83,25.91 48.9,25.91 45.85,28.96 45.85,49.15 44.03,50.97 U3.34
B7: length 36
  Bottom Layer w0.254: U3.35 42.51,48.42 43.23,47.7 43.23,30.28 41.28,28.32 31.37,28.32 H12.5
B8: length 52.6
  Bottom Layer w0.254: OLED1.3 21.46,60.71 27.31,54.86 27.31,48.64 30.06,45.89 U3.36
B9: length 55.5
  Bottom Layer w0.254: U3.37 42.29,44.93 42.29,46.1 41.15,47.24 30.35,47.24 28.45,49.15 28.45,57.53 24,61.98 OLED1.4
B10: length 40.5
  Bottom Layer w0.254: 43.69,93.57 43.69,95.12 44.07,95.5 47.12,95.5 47.37,95.25 47.37,92.58 48.9,91.06 57.02,91.06 58.42,89.66 58.42,72.64 57.06,71.28 U3.15
B11: length 31.1
  Bottom Layer w0.254: HC-SR04.3 46.23,91.57 47.62,90.17 56.77,90.17 57.85,89.09 57.85,75.12 56.55,73.83 U3.16
B12: length 20.4
  Top Layer w0.254: TCRT5000.2 25.2,93.6 28.38,90.42 33.02,90.42 39.46,83.98 U3.21
B13: length 36.3
  Top Layer w0.254: TCRT5000#4.2 13.33,89.66 32.49,89.66 U3.22
B14: length 34.1
  Top Layer w0.254: U3.23 42.04,80.24 42.04,89.66 44.2,91.82 61.47,91.82 TCRT5000#2.2
B15: length 49.8
  Top Layer w0.254: U3.24 42.42,78.08 42.42,89.24 44.64,91.47 74.7,91.47 76.84,93.6
BO1: length 58.5
  Bottom Layer w0.254: H4.2 87.76,31.05 88.89,32.18 88.89,77.96 88.9,77.98 88.9,79.88 86.49,82.3 TB6612.7
BO2: length 51.9
  Bottom Layer w0.254: TB6612.6 85.47,79.76 87.76,77.47 H4.1
C13: length 27
  Top Layer w0.254: U3.2 55.78,38.1 v1(49.78,38.1)
  Bottom Layer w0.254: H12.1 44.83,26.16 46.48,27.81 46.48,37.08 47.5,38.1 v1(49.78,38.1)

## Copper pours and planes (outline as drawn; the poured copper is in the pictures)
GND on Top Layer: -3.81,102.23 92.58,102.23 92.58,-3.56 -3.81,-3.56
GND on Bottom Layer: -3.81,102.45 92.46,102.45 92.46,-3.3 -3.81,-3.3

Small or netless copper shapes (teardrops, artwork), in the pictures only: 87 on Top Layer, 41 on Bottom Layer

## Text on the board
Top Silkscreen Layer: RXD | TXD | DO | GND | VCC | ECHO | TRIG | B7 | A11 | A12 | A15 | C13 | B6 | B5 | B4 | B3 | B1 | AO2 | AO1 | BO2 | BO1
